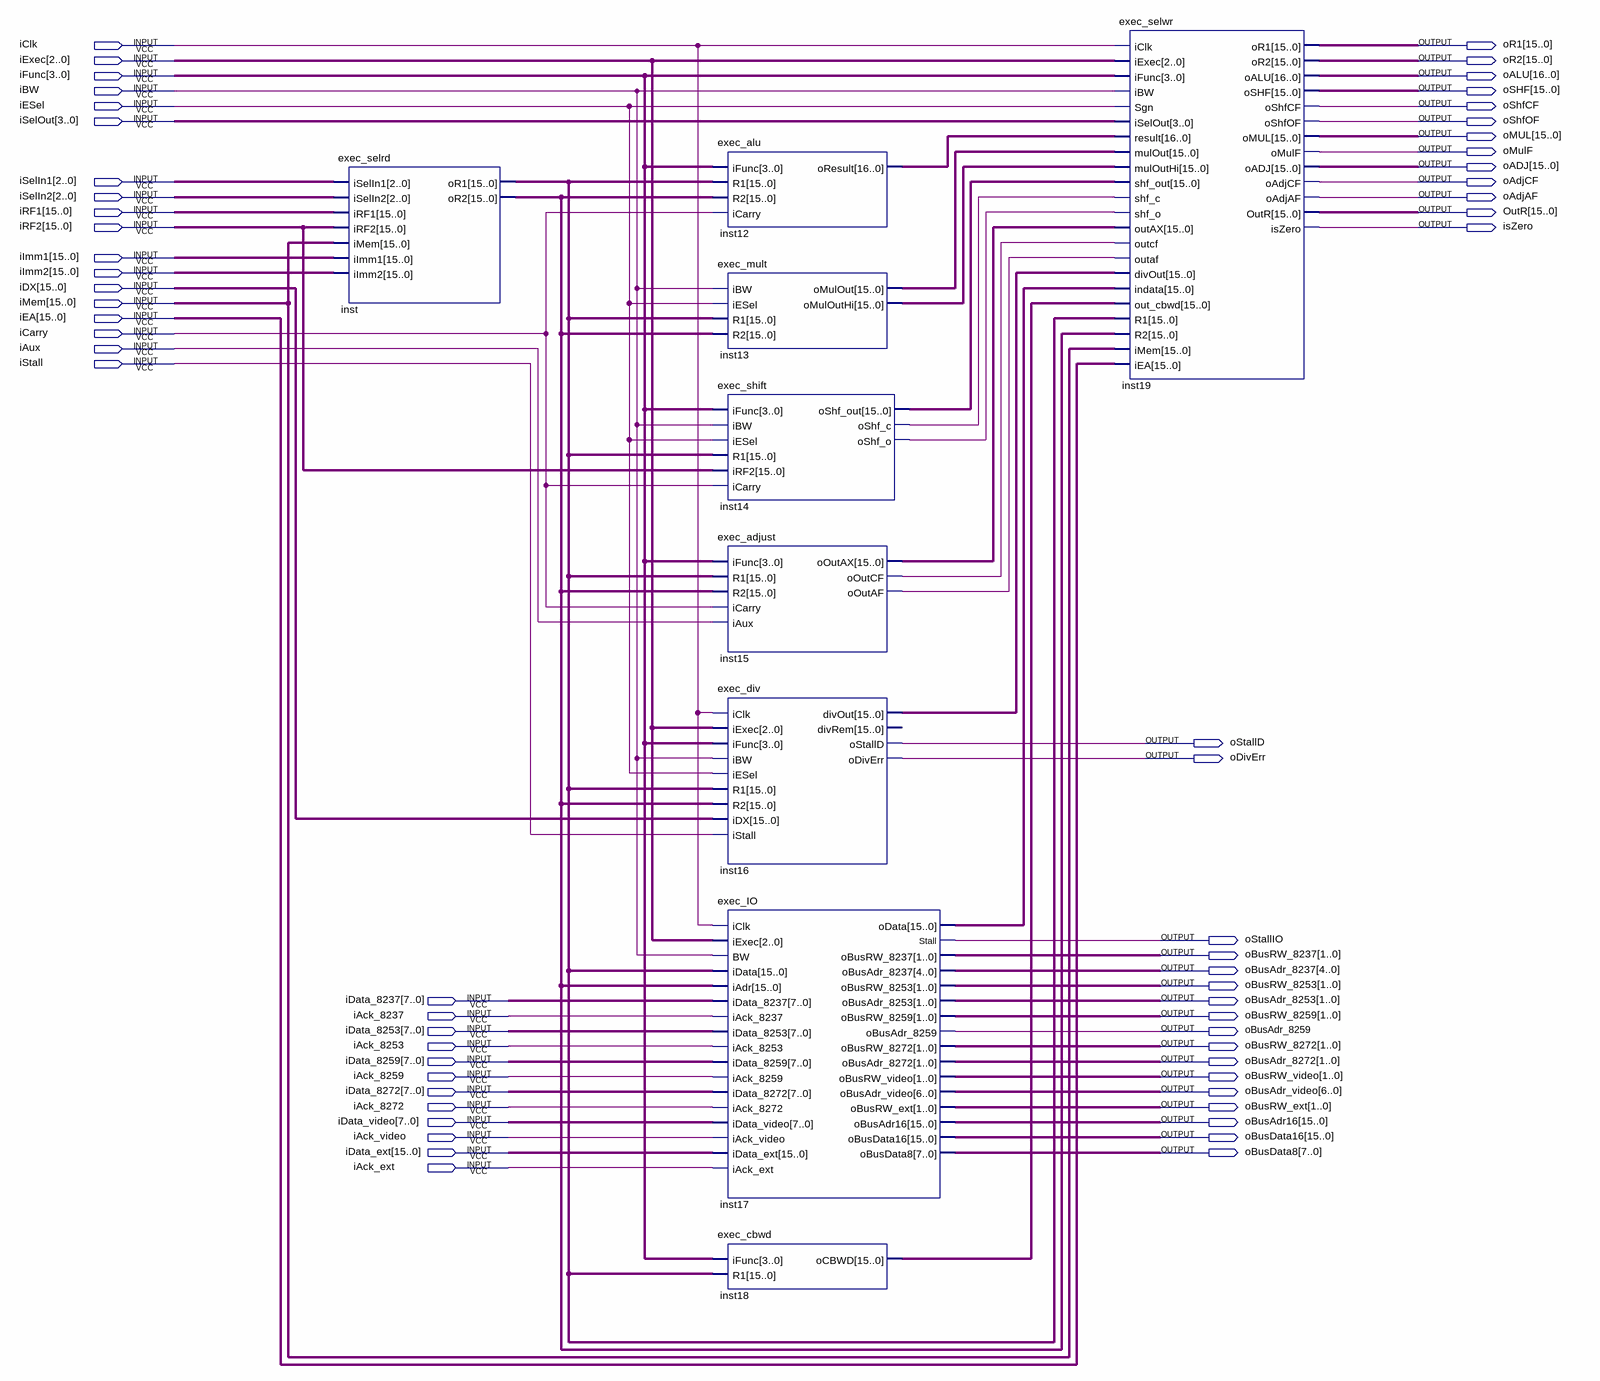
[diagram p0: schematic sheet]
// Quartus schematic exec.bdf as structural Verilog: 9 symbols, 60 pins
module exec (
  input  iClk,
  input  [2:0] iExec,
  input  [3:0] iFunc,
  input  iBW,
  input  iESel,
  input  [3:0] iSelOut,
  input  [2:0] iSelIn1,
  input  [2:0] iSelIn2,
  input  [15:0] iRF1,
  input  [15:0] iRF2,
  input  [15:0] iImm1,
  input  [15:0] iImm2,
  input  [15:0] iDX,
  input  [15:0] iMem,
  input  [15:0] iEA,
  input  iCarry,
  input  iAux,
  input  iStall,
  input  [7:0] iData_8237,
  input  iAck_8237,
  input  [7:0] iData_8253,
  input  iAck_8253,
  input  [7:0] iData_8259,
  input  iAck_8259,
  input  [7:0] iData_8272,
  input  iAck_8272,
  input  [7:0] iData_video,
  input  iAck_video,
  input  [15:0] iData_ext,
  input  iAck_ext,
  output [15:0] oR1,
  output [15:0] oR2,
  output [16:0] oALU,
  output [15:0] oSHF,
  output oShfCF,
  output oShfOF,
  output [15:0] oMUL,
  output oMulF,
  output [15:0] oADJ,
  output oAdjCF,
  output oAdjAF,
  output [15:0] OutR,
  output isZero,
  output oStallD,
  output oDivErr,
  output oStallIO,
  output [1:0] oBusRW_8237,
  output [4:0] oBusAdr_8237,
  output [1:0] oBusRW_8253,
  output [1:0] oBusAdr_8253,
  output [1:0] oBusRW_8259,
  output oBusAdr_8259,
  output [1:0] oBusRW_8272,
  output [1:0] oBusAdr_8272,
  output [1:0] oBusRW_video,
  output [6:0] oBusAdr_video,
  output [1:0] oBusRW_ext,
  output [15:0] oBusAdr16,
  output [15:0] oBusData16,
  output [7:0] oBusData8
);

  wire inst14_oshf_c, inst14_oshf_o, inst15_ooutaf, inst15_ooutcf;
  wire [15:0] inst13_omulout, inst13_omulouthi, inst14_oshf_out, inst15_ooutax, inst16_divout, inst17_odata,
       inst18_ocbwd, inst_or1, inst_or2;
  wire [16:0] inst12_oresult;

  exec_selrd inst (
    .iSelIn1(iSelIn1), .iSelIn2(iSelIn2), .iRF1(iRF1), .iRF2(iRF2), .iMem(iMem), .iImm1(iImm1),
    .iImm2(iImm2), .oR1(inst_or1), .oR2(inst_or2));
  exec_alu inst12 (.iFunc(iFunc), .R1(inst_or1), .R2(inst_or2), .iCarry(iCarry), .oResult(inst12_oresult));
  exec_mult inst13 (
    .iBW(iBW), .iESel(iESel), .R1(inst_or1), .R2(inst_or2), .oMulOut(inst13_omulout),
    .oMulOutHi(inst13_omulouthi));
  exec_shift inst14 (
    .iFunc(iFunc), .iBW(iBW), .iESel(iESel), .R1(inst_or1), .iRF2(iRF2), .iCarry(iCarry),
    .oShf_out(inst14_oshf_out), .oShf_c(inst14_oshf_c), .oShf_o(inst14_oshf_o));
  exec_adjust inst15 (
    .iFunc(iFunc), .R1(inst_or1), .R2(inst_or2), .iCarry(iCarry), .iAux(iAux), .oOutAX(inst15_ooutax),
    .oOutCF(inst15_ooutcf), .oOutAF(inst15_ooutaf));
  exec_div inst16 (
    .iClk(iClk), .iExec(iExec), .iFunc(iFunc), .iBW(iBW), .iESel(iESel), .R1(inst_or1), .R2(inst_or2),
    .iDX(iDX), .iStall(iStall), .divOut(inst16_divout), .oStallD(oStallD), .oDivErr(oDivErr));  // open: divRem
  exec_IO inst17 (
    .iClk(iClk), .iExec(iExec), .BW(iBW), .iData(inst_or1), .iAdr(inst_or2), .iData_8237(iData_8237),
    .iAck_8237(iAck_8237), .iData_8253(iData_8253), .iAck_8253(iAck_8253), .iData_8259(iData_8259),
    .iAck_8259(iAck_8259), .iData_8272(iData_8272), .iAck_8272(iAck_8272), .iData_video(iData_video),
    .iAck_video(iAck_video), .iData_ext(iData_ext), .iAck_ext(iAck_ext), .oData(inst17_odata),
    .Stall(oStallIO), .oBusRW_8237(oBusRW_8237), .oBusAdr_8237(oBusAdr_8237), .oBusRW_8253(oBusRW_8253),
    .oBusAdr_8253(oBusAdr_8253), .oBusRW_8259(oBusRW_8259), .oBusAdr_8259(oBusAdr_8259),
    .oBusRW_8272(oBusRW_8272), .oBusAdr_8272(oBusAdr_8272), .oBusRW_video(oBusRW_video),
    .oBusAdr_video(oBusAdr_video), .oBusRW_ext(oBusRW_ext), .oBusAdr16(oBusAdr16), .oBusData16(oBusData16),
    .oBusData8(oBusData8));
  exec_cbwd inst18 (.iFunc(iFunc), .R1(inst_or1), .oCBWD(inst18_ocbwd));
  exec_selwr inst19 (
    .iClk(iClk), .iExec(iExec), .iFunc(iFunc), .iBW(iBW), .Sgn(iESel), .iSelOut(iSelOut),
    .result(inst12_oresult), .mulOut(inst13_omulout), .mulOutHi(inst13_omulouthi), .shf_out(inst14_oshf_out),
    .shf_c(inst14_oshf_c), .shf_o(inst14_oshf_o), .outAX(inst15_ooutax), .outcf(inst15_ooutcf),
    .outaf(inst15_ooutaf), .divOut(inst16_divout), .indata(inst17_odata), .out_cbwd(inst18_ocbwd),
    .R1(inst_or1), .R2(inst_or2), .iMem(iMem), .iEA(iEA), .oR1(oR1), .oR2(oR2), .oALU(oALU), .oSHF(oSHF),
    .oShfCF(oShfCF), .oShfOF(oShfOF), .oMUL(oMUL), .oMulF(oMulF), .oADJ(oADJ), .oAdjCF(oAdjCF),
    .oAdjAF(oAdjAF), .OutR(OutR), .isZero(isZero));
endmodule
